# Altium project Cloud_Tub_Controller.PrjPcb
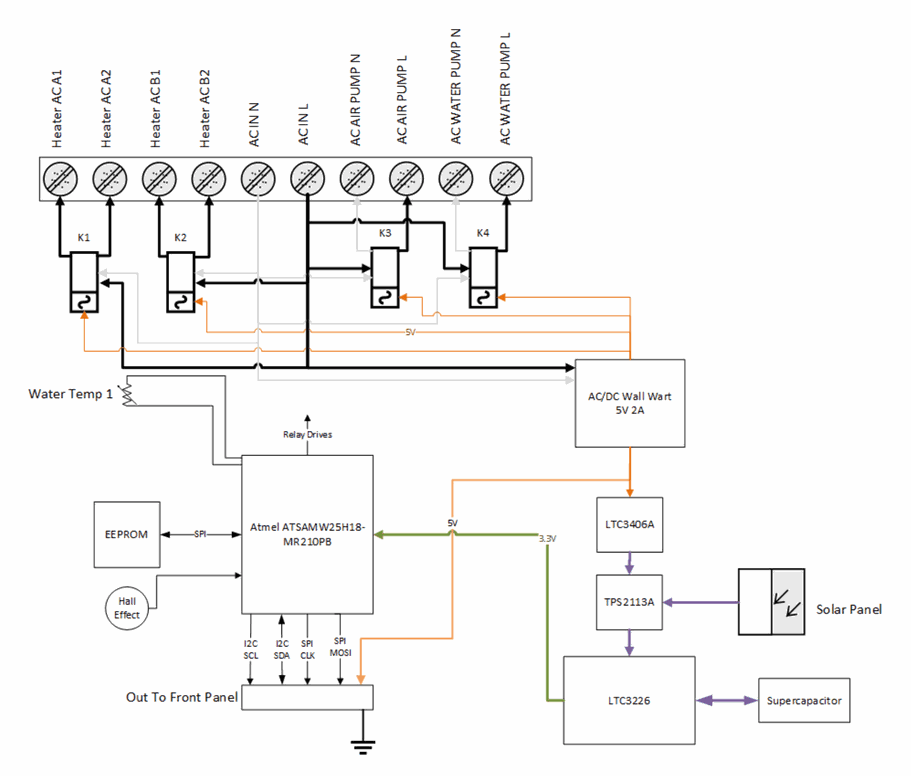
[diagram p0: PAGE1_BLOCK_DIAGRAM.SchDoc]
4 sheets, 98 parts. Net scope: flat (ports and power ports of the same name join across sheets).
Board file: PCB.PcbDoc
Sheets:
  PAGE1_BLOCK_DIAGRAM.SchDoc
  PAGE2_ATMEL.SchDoc
  PAGE3_POWER.SchDoc
  PAGE4_RELAYS.SchDoc

## Sheet PAGE1_BLOCK_DIAGRAM.SchDoc
size A; DrawnBy: Sean Donohue; Revision: A; SheetNumber: 1; SheetTotal: 4; Title2: BLOCK DIAGRAM

### Notes on the sheet
- 1
- 2
- 3
- 4
- A
- B
- C
- D
- Title
- Drawn:
- Number:
- Rev:
- File:
- Date:
- Time:
- Sheet
- of

## Sheet PAGE2_ATMEL.SchDoc
size A; DrawnBy: Sean Donohue; Revision: A; SheetNumber: 2; SheetTotal: 4; Title2: ATMEL
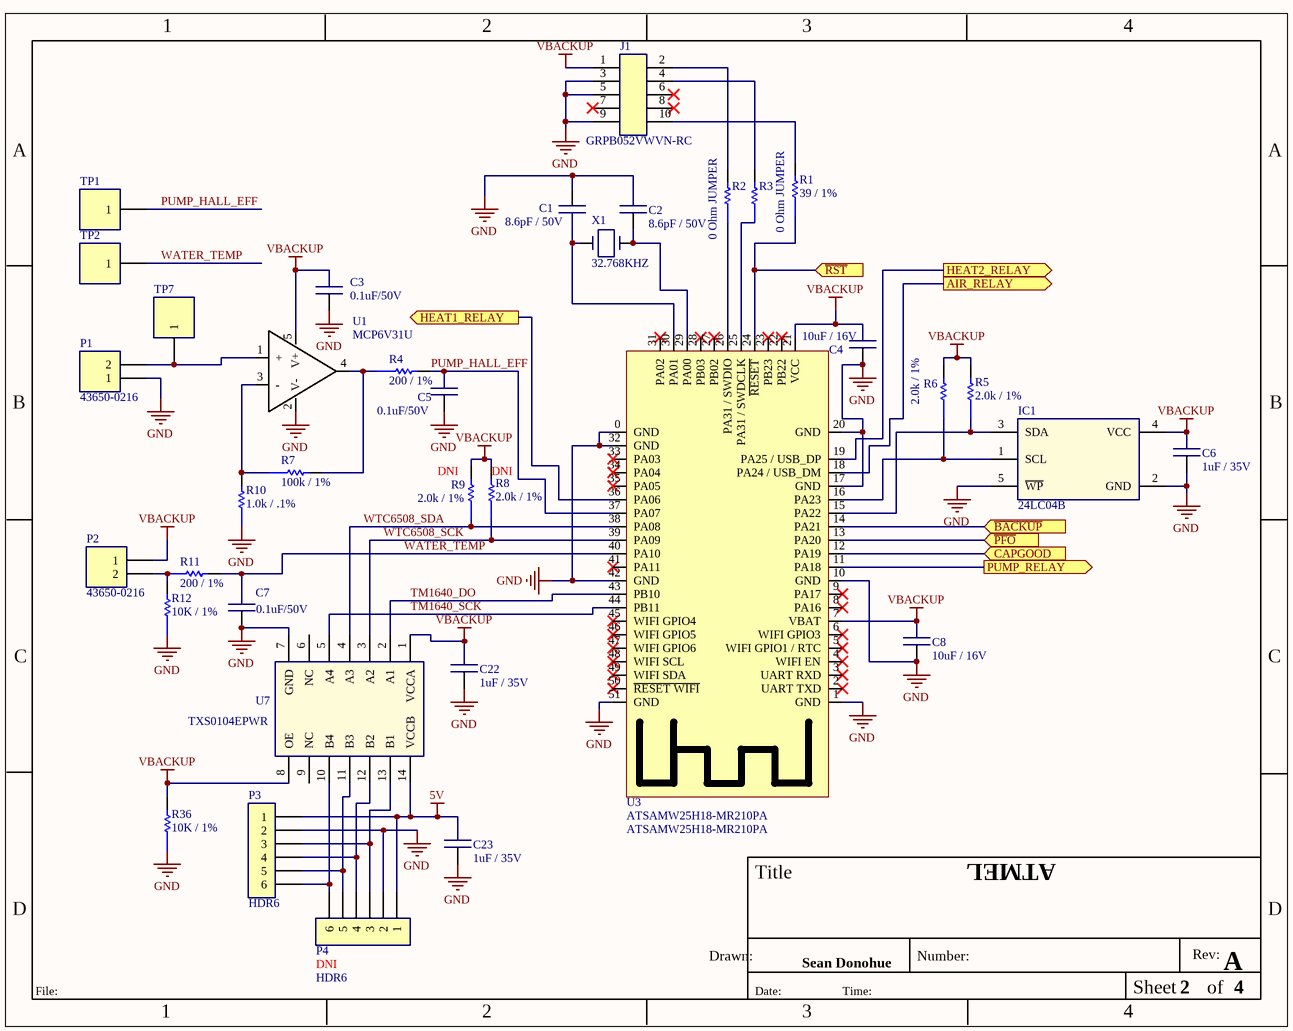
[diagram p1: PAGE2_ATMEL.SchDoc]

### Parts
C1  value 8.6pF / 50V  [0603]  (hidden comment: cap)
C2  value 8.6pF / 50V  [0603]  (hidden comment: cap)
C3  value 0.1uF/50V  [0603]  (hidden comment: cap)
C4  value 10uF / 16V  [0603]  (hidden comment: cap)
C5  value 0.1uF/50V  [0603]  (hidden comment: cap)
C6  value 1uF / 35V  [0603]  (hidden comment: cap)
C7  value 0.1uF/50V  [0603]  (hidden comment: cap)
C8  value 10uF / 16V  [0603]  (hidden comment: cap)
C22  value 1uF / 35V  [0603]  (hidden comment: cap)
C23  value 1uF / 35V  [0603]  (hidden comment: cap)
IC1  24LC04B  [SOT-23-5]
J1  value GRPB052VWVN-RC  [conn_10p_050mil]  (hidden comment: Header 10D)
P1  value 43650-0216  [conn_molex_2p_43650-0215]  (hidden comment: Header 2)
P2  value 43650-0216  [conn_molex_2p_43650-0215]  (hidden comment: Header 2)
P3  value HDR6  [HDR1X6]  (hidden comment: Header 6)
P4  value HDR6  LOAD: DNI  [HDR1X6]  (hidden comment: Header 6)
R1  value 39 / 1%  [0603]  (hidden comment: Res)
R2  value 0 Ohm JUMPER  [0603]  (hidden comment: Res)
R3  value 0 Ohm JUMPER  [0603]  (hidden comment: Res)
R4  value 200 / 1%  [0603]  (hidden comment: Res)
R5  value 2.0k / 1%  [0603]  (hidden comment: Res)
R6  value 2.0k / 1%  [0603]  (hidden comment: Res)
R7  value 100k / 1%  [0603]  (hidden comment: Res)
R8  value 2.0k / 1%  LOAD: DNI  [0603]  (hidden comment: Res)
R9  value 2.0k / 1%  LOAD: DNI  [0603]  (hidden comment: Res)
R10  value 1.0k / .1%  [0603]  (hidden comment: Res)
R11  value 200 / 1%  [0603]  (hidden comment: Res)
R12  value 10K / 1%  [0603]  (hidden comment: Res)
R36  value 10K / 1%  [0603]  (hidden comment: Res)
TP1  Header 1  [HDR1]  (value not drawn)
TP2  Header 1  [HDR1]  (value not drawn)
TP7  Header 1  [HDR1]  (value not drawn)
U1  MCP6V31U  [SOT-23-5]
U3  ATSAMW25H18-MR210PA  [ATSAMW25H18-MR210PA]
U7  TXS0104EPWR  [TSSOP-14]
X1  value 32.768KHZ  [FC-13F]  (hidden comment: crystal)

### Ports
AIR_RELAY (out), CAPGOOD (in), HEAT1_RELAY (out), HEAT2_RELAY (out), PUMP_RELAY (out), ~{BACKUP} (in), ~{PFO} (in), ~{RST} (in)

### Nets
5V: C23.1 P3.1 P4.1 U7.14(VCCB)
GND: C1.2 C2.1 C3.2 C4.2 C5.2 C6.2 C7.2 C8.2 C22.2 C23.2 IC1.2(GND) IC1.5(~{WP}) J1.3 J1.5 J1.9 P1.1 P3.2 P4.2 R10.1 R12.1 R36.1 U1.2(V-) U3.0(GND) U3.1(GND) U3.10(GND) U3.17(GND) U3.20(GND) U3.32(GND) U3.42(GND) U3.51(GND) U7.7(GND)
VBACKUP: C3.1 C4.1 C6.1 C8.1 C22.1 IC1.4(VCC) J1.1 P2.1 R5.2 R6.2 R8.2 R9.2 R36.2 U1.5(V+) U3.7(VBAT) U3.21(VCC) U7.1(VCCA) U7.8(OE)
PUMP_HALL_EFF: C5.1 R4.2 TP1.1 U3.37(PA07)
TM1640_DO: U3.43(PB10) U7.2(A1)
TM1640_SCK: U3.44(PB11) U7.5(A4)
WATER_TEMP: C7.1 R11.2 TP2.1 U3.40(PA10)
WTC6508_SCK: R8.1 U3.39(PA09) U7.3(A2)
WTC6508_SDA: R9.1 U3.38(PA08) U7.4(A3)
NetC1_1: C1.1 U3.30(PA01) X1.1
NetC2_2: C2.2 U3.29(PA00) X1.2
NetIC1_1: IC1.1(SCL) R6.1 U3.16(PA23)
NetIC1_3: IC1.3(SDA) R5.1 U3.15(PA22)
NetJ1_2: J1.2 R2.2
NetJ1_4: J1.4 R3.2
NetJ1_10: J1.10 R1.2
NetP1_2: P1.2 TP7.1 U1.1(+)
NetP2_2: P2.2 R11.1 R12.2
NetP3_3: P3.3 P4.3 U7.13(B1)
NetP3_4: P3.4 P4.4 U7.12(B2)
NetP3_5: P3.5 P4.5 U7.11(B3)
NetP3_6: P3.6 P4.6 U7.10(B4)
NetR1_1: R1.1 U3.24(~{RESET}) ; port ~{RST}
NetR2_1: R2.1 U3.26(PA31_/_SWDIO)
NetR3_1: R3.1 U3.25(PA31_/_SWDCLK)
NetR4_1: R4.1 R7.2 U1.4(OUTA)
NetR7_1: R7.1 R10.2 U1.3(-)
NetR17_1: U3.14(PA21) ; port ~{BACKUP}
NetR25_1: U3.12(PA19) ; port CAPGOOD
NetR26_1: U3.13(PA20) ; port ~{PFO}
NetR28_1: U3.19(PA25_/_USB_DP) ; port HEAT2_RELAY
NetR29_1: U3.11(PA18) ; port PUMP_RELAY
NetR30_1: U3.18(PA24_/_USB_DM) ; port AIR_RELAY
NetR34_1: U3.36(PA06) ; port HEAT1_RELAY

Not connected (* = marked no-connect by the designer): J1 6* 7* 8*; U3 2(UART_TXD)* 3(UART_RXD)* 4(WIFI_EN)* 5(WIFI_GPIO1_/_RTC)* 6(WIFI_GPIO3)* 8(PA16)* 9(PA17)* 22(PB22)* 23(PB23)* 27(PB02)* 28(PB03)* 31(PA02)* 33(PA03)* 34(PA04)* 35(PA05)* 41(PA11)* 45(WIFI_GPIO4)* 46(WIFI_GPIO5)* 47(WIFI_GPIO6)* 48(WIFI_SCL)* 49(WIFI_SDA)* 50(~{RESET_WIFI})*; U7 6(NC) 9(NC)

### Notes on the sheet
- 1
- 2
- 3
- 4
- A
- B
- C
- D
- Title
- Drawn:
- Number:
- Rev:
- File:
- Date:
- Time:
- Sheet
- of

### Library data of the parts
C1 C2 = EXC143: CAP CER 8.2PF 50V NP0 0603; EetrexPN: EXC143; Mfg: KEMET; MfgPN: C0603C829J5GACTU; Vendor: Digikey; VendorPN: 399-7965-1-ND; Unit Cost: 0.25; Temp: -55°C ~ 125°C
C3 C5 C7 = ECM1045XQ: CAP CER 0.1UF 50V 10% X7R 0603; Mfg: Murata; MfgPN: GRM188R71H104KA93D; Vendor: Digikey; VendorPN: 490-1519-1-ND; Alt Mfg: TDK; Alt PN: C1608X7R1H104K; Unit Cost: 0.1; Temp: -55°C ~ 125°C; COST/10: 0.041; COST/50: 0.0222; COST/100: 0.0187; COST/500: 0.0131; EetrexPN: ECM1045XQ
C4 C8 = EXC142: CAP CER 10UF 16V X5R 0603; EetrexPN: EXC142; Mfg: Taiyo Uden; MfgPN: EMK107BBJ106MA-T; Vendor: Digkey; VendorPN: 587-3238-1-ND; Unit Cost: 0.63; Temp: -55°C ~ 85°C
C6 C22 C23 = EXC144: CAP CER 1UF 35V X7R 0603; EetrexPN: EXC144; Mfg: Murata; MfgPN: GRM188R7YA105KA12D; Vendor: Digikey; VendorPN: 490-10487-1-ND; Unit Cost: 0.27; Temp: -55°C ~ 125°C
IC1 = EXM2404ST: IC SERIAL EEPROM 4K 2.5V SOT23-5; Mfg: Microchip; MfgPN: 24LC04BT-I/OT; Vendor: Digikey; VendorPN: 24LC04BT-I/OTCT-ND; Unit Cost: 0.22; Value: 24LC04B; EetrexPN: EXM2404ST
J1 = EKP115: CONN HEADER 10POS 1.27MM GOLD T/H; EetrexPN: EKP115; Mfg: Sullins; Vendor: Digikey; VendorPN: S9015E-05-ND; Unit Cost: 0.90; MfgPN: GRPB052VWVN-RC
P1 P2 = EKP96: CONN HEADER 2POS 3MM VERT GOLD; EetrexPN: EKP96; Mfg: Molex; Vendor: Digikey; VendorPN: WM1922-ND; Alt PN: 43650-0417; Unit Cost: 0.86; Temp: -40°C ~ 105°C; UL: YES; MATE PN: 43645-0200; COST/10: 0.757; COST/50: 0.6826; COST/100: 0.653; COST/500: 0.53424; MfgPN: 43650-0216; Alt Mfg: Molex; CSA: YES
P3 P4 = ekp19: CONN HEADER 6POS .330 tall, TIN; EetrexPN: ekp19; Mfg: Samtec; MfgPN: TSW-106-07-T-S; Vendor: Digikey; VendorPN: SAM1035-06-ND; Unit Cost: 0.50
R1 = ER273: RES 39 OHM 1% 1/10W 0603 SMD; Mfg: Panasonic; MfgPN: ERJ-3EKF39R0V; Vendor: Digikey; VendorPN: P39.0HDKR-ND; EetrexPN: ER273; Unit Cost: 0.1; Temp: -55°C ~ 155°C
R2 R3 = ERE0000JP: RES 0.0 OHM 1/10W 0603 SMD; Mfg: Stackpole; MfgPN: RMCF0603ZT0R00; Vendor: Digikey; VendorPN: RMCF0603ZT0R00CT-ND; Alt Mfg: Panasonic; Alt PN: ERJ-3GEY0R00V; Unit Cost: 0.02; Temp: -55°C ~ 155°C; COST/10: 0.017; COST/50: 0.0092; COST/100: 0.007; COST/500: 0.00384; EetrexPN: ERE0000JP
R4 R11 = ER264: RES 200 OHM 1% 1/10W 0603 SMD; Mfg: Panasonic; MfgPN: ERJ-3EKF2000V; Vendor: Digikey; VendorPN: P200HCT-ND; EetrexPN: ER264; Unit Cost: 0.1; Temp: -55°C ~ 155°C
R5 R6 R8 R9 = ERE2001FP: RES 2.00K OHM 1/10W 1% 0603 SMD; Mfg: Vishay; MfgPN: CRCW06032K00FKEA; Vendor: Digikey; VendorPN: 541-2.00KHCT-ND; Alt Mfg: Panasonic; Alt PN: ERJ-3EKF2001V; Unit Cost: 0.081; Temp: -55°C ~ 155°C; COST/50: 0.0436; COST/500: 0.0251; EetrexPN: ERE2001FP; COST/10: 0.081; COST/100: 0.0436
R7 = ERE1003FP: RES 100K OHM 1/10W 1% 0603 SMD; Mfg: Panasonic; MfgPN: ERJ-3EKF1003V; Vendor: Digikey; VendorPN: P100KHCT-ND; Alt Mfg: Yageo; Alt PN: RC0603FR-07100KL; Unit Cost: 0.1; Temp: '-55°C ~ 125°C; COST/50: 0.015; COST/100: 0.0114; COST/500: 0.00624; EetrexPN: ERE1003FP; COST/10: 0.1
R10 = ERE1001BP: RES 1.0K OHM 1/10W .1% 0603 SMD; Mfg: Panasonic; MfgPN: ERA-3AEB102V; Vendor: Digikey; VendorPN: P1.0KDBCT-ND; Alt Mfg: Susumu; Alt PN: RG1608P-102-B-T5; Unit Cost: 0.124; Ref: ER150; EetrexPN: ERE1001BP
R12 R36 = ER275: RES 10K OHM 1% 1/8W 0603 SMD; Mfg: Vishay; MfgPN: MCT06030C1002FP500; Vendor: Digikey; VendorPN: MCT0603-10.0K-CFCT-ND; EetrexPN: ER275; Unit Cost: 0.17; Temp: -55°C ~ 155°C
TP1 TP2 TP7 = ekp17: CONN HEADER 1POS .330 tall, TIN; Value: HDR1; EetrexPN: ekp17; Mfg: Samtec; MfgPN: TSW-101-07-T-S; Vendor: Digikey; VendorPN: SAM1035-01-ND; Unit Cost: 0.36
U1 = E326: IC OPAMP ZRO-DRFT 300KHZ SC70-5; EetrexPN: E326; Mfg: MicroChip; MfgPN: MCP6V31UT-E/LT; Vendor: Digikey; VendorPN: MCP6V31UT-E/LTCT-ND; Unit Cost: 1.08; Temp: -40°C ~ 125°C; COST/100: 0.82; Value: MCP6V31U
U3 = E329: RF TXRX MODULE WIFI TRACE ANT; EetrexPN: E329; Mfg: Atmel; Vendor: Digikey; VendorPN: ATSAMW25H18-MR210PA-ND; Unit Cost: 26.25; Temp: -40°C ~ 85°C; COST/10: 24.235; COST/100: 20.5326; COST/500: 18.7; Value: ATSAMW25H18-MR210PA; MfgPN: ATSAMW25H18-MR210PA
U7 = E334: IC 4BIT NON-INV TRANSLTR 14TSSOP; EetrexPN: E334; Mfg: Texas Instruments; Vendor: Digikey; VendorPN: 296-20697-1-ND; Unit Cost: 1.44; Temp: -40°C ~ 85°C; Value: TXS0104EPWR; MfgPN: TXS0104EPWR
X1 = EQX7: CRYSTAL 32.768KHZ 7PF SMD; EetrexPN: EQX7; Mfg: AVX; MfgPN: ST3215SB32768C0HPWBB; Vendor: Digikey; VendorPN: 1253-1113-1-ND; Unit Cost: 0.87; TEMP: -40°C ~ 85°C; COST/10: 0.774; COST/50: 0.7232; COST/100: 0.64; COST/500: 0.6048

## Sheet PAGE3_POWER.SchDoc
size A; DrawnBy: Sean Donohue; Revision: A; SheetNumber: 3; SheetTotal: 4; Title2: POWER
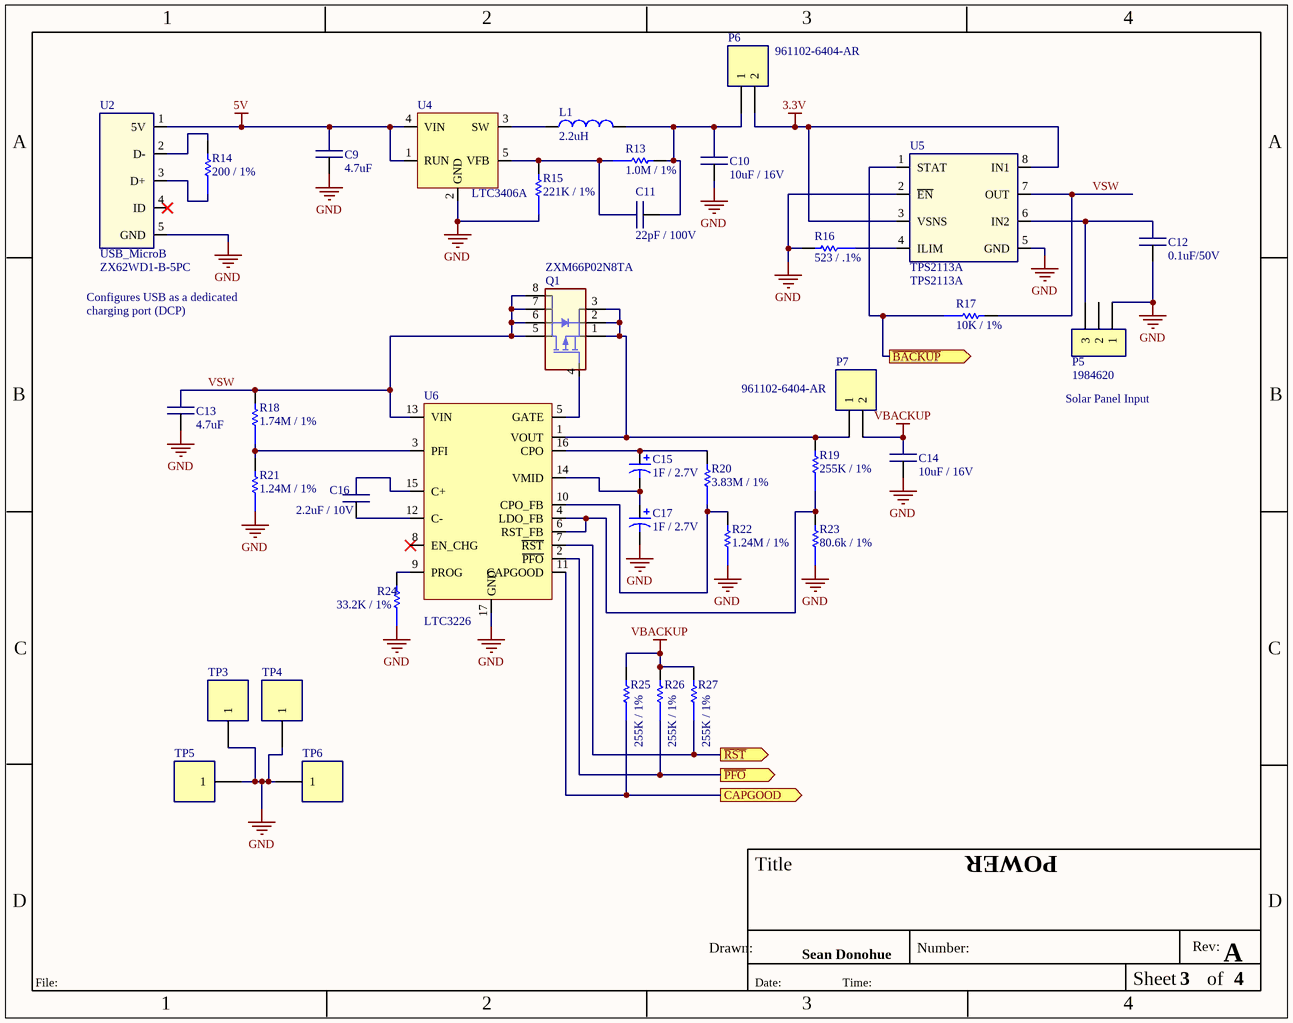
[diagram p2: PAGE3_POWER.SchDoc]

### Parts
C9  value 4.7uF  [0805]  (hidden comment: cap)
C10  value 10uF / 16V  [0603]  (hidden comment: cap)
C11  value 22pF / 100V  [0603]  (hidden comment: cap)
C12  value 0.1uF/50V  [0603]  (hidden comment: cap)
C13  value 4.7uF  [0805]  (hidden comment: cap)
C14  value 10uF / 16V  [0603]  (hidden comment: cap)
C15  value 1F / 2.7V  [Cap8x11_5]  (hidden comment: Cap Pol)
C16  value 2.2uF / 10V  [0603]  (hidden comment: cap)
C17  value 1F / 2.7V  [Cap8x11_5]  (hidden comment: Cap Pol)
L1  value 2.2uH  [LQH32C]  (hidden comment: Inductor)
P5  value 1984620  [CONN_PHOENIX_3P_1984620]  (hidden comment: Header 3)
P6  value 961102-6404-AR  [HDR1X2]  (hidden comment: Header 2)
P7  value 961102-6404-AR  [HDR1X2]  (hidden comment: Header 2)
Q1  value ZXM66P02N8TA  [SO-8]  (hidden comment: PMOS_POWER-8)
R13  value 1.0M / 1%  [0603]  (hidden comment: Res)
R14  value 200 / 1%  [0603]  (hidden comment: Res)
R15  value 221K / 1%  [0603]  (hidden comment: Res)
R16  value 523 / .1%  [0603]  (hidden comment: Res)
R17  value 10K / 1%  [0603]  (hidden comment: Res)
R18  value 1.74M / 1%  [0603]  (hidden comment: Res)
R19  value 255K / 1%  [0603]  (hidden comment: Res)
R20  value 3.83M / 1%  [0603]  (hidden comment: Res)
R21  value 1.24M / 1%  [0603]  (hidden comment: Res)
R22  value 1.24M / 1%  [0603]  (hidden comment: Res)
R23  value 80.6k / 1%  [0603]  (hidden comment: Res)
R24  value 33.2K / 1%  [0603]  (hidden comment: Res)
R25  value 255K / 1%  [0603]  (hidden comment: Res)
R26  value 255K / 1%  [0603]  (hidden comment: Res)
R27  value 255K / 1%  [0603]  (hidden comment: Res)
TP3  Header 1  [HDR1]  (value not drawn)
TP4  Header 1  [HDR1]  (value not drawn)
TP5  Header 1  [HDR1]  (value not drawn)
TP6  Header 1  [HDR1]  (value not drawn)
U2  USB_MicroB  value ZX62WD1-B-5PC  [ZX62WD1-B-5PC]
U4  LTC3406A  [TSOT-23-5]
U5  TPS2113A  [TSSOP-8]
U6  LTC3226  [WFQFN-16]

### Ports
CAPGOOD (out), ~{BACKUP} (out), ~{PFO} (out), ~{RST} (out)

### Nets
3.3V: P6.2 U5.3(VSNS) U5.8(IN1)
5V: C9.1 U2.1(5V) U4.1(RUN) U4.4(VIN)
GND: C9.2 C10.2 C12.2 C13.2 C14.2 C17.2 P5.1 R15.1 R16.2 R21.1 R22.1 R23.1 R24.1 TP3.1 TP4.1 TP5.1 TP6.1 U2.5(GND) U4.2(GND) U5.2(~{EN}) U5.5(GND) U6.17(GND)
VBACKUP: C14.1 P7.2 R25.2 R26.2 R27.2
VSW: C13.1 Q1.5(D) Q1.6(D) Q1.7(D) Q1.8(D) R17.2 R18.2 U5.7(OUT) U6.13(VIN)
NetC10_1: C10.1 C11.2 L1.2 P6.1 R13.2
NetC11_1: C11.1 R13.1 R15.2 U4.5(VFB)
NetC12_1: C12.1 P5.3 U5.6(IN2)
NetC15_1: C15.1 R20.2 U6.16(CPO)
NetC15_2: C15.2 C17.1 U6.14(VMID)
NetC16_1: C16.1 U6.15(C+)
NetC16_2: C16.2 U6.12(C-)
NetL1_1: L1.1 U4.3(SW)
NetP7_1: P7.1 Q1.1(S) Q1.2(S) Q1.3(S) R19.2 U6.1(VOUT)
NetQ1_4: Q1.4(G) U6.5(GATE)
NetR1_1: R27.1 U6.7(~{RST}) ; port ~{RST}
NetR14_1: R14.1 U2.3(D+)
NetR14_2: R14.2 U2.2(D-)
NetR16_1: R16.1 U5.4(ILIM)
NetR17_1: R17.1 U5.1(STAT) ; port ~{BACKUP}
NetR18_1: R18.1 R21.2 U6.3(PFI)
NetR19_1: R19.1 R23.2 U6.4(LDO_FB) U6.6(RST_FB)
NetR20_1: R20.1 R22.2 U6.10(CPO_FB)
NetR24_2: R24.2 U6.9(PROG)
NetR25_1: R25.1 U6.11(CAPGOOD) ; port CAPGOOD
NetR26_1: R26.1 U6.2(~{PFO}) ; port ~{PFO}

Not connected (* = marked no-connect by the designer): P5 2; U2 4(ID)*; U6 8(EN_CHG)*

### Notes on the sheet
- Configures USB as a dedicated charging port (DCP)
- Solar Panel Input
- 1
- 2
- 3
- 4
- A
- B
- C
- D
- Title
- Drawn:
- Number:
- Rev:
- File:
- Date:
- Time:
- Sheet
- of

### Library data of the parts
C9 C13 = ECC4702XR: CAP 4.7uF 16V X7R 0805; Mfg: Murata; MfgPN: GRM21BR71C475KA73L; Vendor: Digikey; VendorPN: 490-4522-1; Unit Cost: 0.88; Temp: '-55°C ~ 125°C; EetrexPN: ECC4702XR
C10 C14 = EXC142: as C4 on sheet PAGE2_ATMEL
C11 = EXC140: CAP CER 22PF 100V NP0 0603; EetrexPN: EXC140; Mfg: KEMET; MfgPN: C0603C220J1GACTU; Vendor: Digikey; VendorPN: 399-7874-1-ND; Unit Cost: 0.1; Temp: -55°C ~ 125°C
C12 = ECM1045XQ: as C3 on sheet PAGE2_ATMEL; EetrexPN: ECM1045XQ
C15 C17 = EXC139: CAP 1F 2.7V THROUGH HOLE; EetrexPN: EXC139; Mfg: Maxwell; MfgPN: BCAP0001 P270 T01; Vendor: Digikey; VendorPN: 1182-1006-ND; Unit Cost: 2.3; Temp: -40°C ~ 85°C
C16 = EXC141: CAP CER 2.2UF 10V X7R 0603; EetrexPN: EXC141; Mfg: Samsung; MfgPN: CL10B225KP8NFNC; Vendor: Digikey; VendorPN: 1276-2016-1-ND; Unit Cost: 0.15; Temp: -55°C ~ 125°C
L1 = EL48: FIXED IND 2.2UH 790MA 97 MOHM; EetrexPN: EL48; Mfg: Murata; MfgPN: LQH32CN2R2M53L; Vendor: Digikey; VendorPN: 490-4056-1-ND; Unit Cost: 0.35; Temp: -40°C ~ 85°C
P5 = EKP73: CONN TERM BLOCK T/H 3POS 3.5MM; EetrexPN: EKP73; Mfg: Phoenix Contact; Vendor: Digikey; VendorPN: 277-1722-ND; Unit Cost: 0.55; UL: YES; MfgPN: 1984620; CSA: YES
P6 P7 = EKP117: CONN HEADER VERT SGL 2POS GOLD; EetrexPN: EKP117; Mfg: 3M; Vendor: Digikey; VendorPN: 3M9447-ND; Unit Cost: 0.16; MfgPN: 961102-6404-AR
Q1 = E333: MOSFET P-CH 20V 8A 8-SOIC; EetrexPN: E333; Mfg: Diodes inc; Vendor: Digikey; VendorPN: ZXM66P02N8CT-ND; Unit Cost: 2.61; Temp: -55°C ~ 150°C; MfgPN: ZXM66P02N8TA
R13 = ER265: RES 1M OHM 1% 1/10W 0603 SMD; Mfg: Panasonic; MfgPN: ERJ-3EKF1004V; Vendor: Digikey; VendorPN: P1.00MHCT-ND; EetrexPN: ER265; Unit Cost: 0.1; Temp: -55°C ~ 155°C
R14 = ER264: as R4 on sheet PAGE2_ATMEL
R15 = ER266: RES 221K OHM 1% 1/10W 0603 SMD; Mfg: Panasonic; MfgPN: ERJ-3EKF2213V; Vendor: Digikey; VendorPN: P221KHCT-ND; EetrexPN: ER266; Unit Cost: 0.1; Temp: -55°C ~ 155°C
R16 = ERE5230BP: RES 523 OHM 1/10W .1% 0603 SMD; Mfg: Susumu; MfgPN: RG1608P-5230-B-T5; Vendor: Digikey; VendorPN: RG16P523BCT-ND; Alt Mfg: Panasonic; Alt PN: ERA-3AEB5230V; Unit Cost: 0.204; Ref: ER149; EetrexPN: ERE5230BP
R17 = ER275: as R12 on sheet PAGE2_ATMEL
R18 = ER268: RES 1.74M OHM 1% 1/10W 0603 SMD; Mfg: Vishay; MfgPN: CRCW06031M74FKEA; Vendor: Digikey; VendorPN: 541-1.74MHCT-ND; EetrexPN: ER268; Unit Cost: 0.1; Temp: -55°C ~ 155°C
R19 R25-R27 = ER270: RES 255K OHM 1% 1/10W 0603 SMD; Mfg: Panasonic; MfgPN: ERJ-3EKF2553V; Vendor: Digikey; VendorPN: P255KHCT-ND; EetrexPN: ER270; Unit Cost: 0.1; Temp: -55°C ~ 155°C
R20 = ER272: RES 3.83M OHM 1% 1/10W 0603 SMD; Mfg: Vishay; MfgPN: CRCW06033M83FKEA; Vendor: Digikey; VendorPN: 541-3.83MHCT-ND; EetrexPN: ER272; Unit Cost: 0.1; Temp: -55°C ~ 155°C
R21 R22 = ER269: RES 1.24M OHM 1% 1/10W 0603 SMD; Mfg: Vishay; MfgPN: CRCW06031M24FKEA; Vendor: Digikey; VendorPN: 541-1.24MHCT-ND; EetrexPN: ER269; Unit Cost: 0.1; Temp: -55°C ~ 155°C
R23 = ER271: RES 80.6K OHM 1% 1/10W 0603 SMD; Mfg: Panasonic; MfgPN: ERJ-3EKF8062V; Vendor: Digikey; VendorPN: P80.6KHCT-ND; EetrexPN: ER271; Unit Cost: 0.1; Temp: -55°C ~ 155°C
R24 = ER267: RES 33.2K OHM 1% 1/10W 0603 SMD; Mfg: Panasonic; MfgPN: ERJ-3EKF3322V; Vendor: Digikey; VendorPN: P33.2KHCT-ND; EetrexPN: ER267; Unit Cost: 0.1; Temp: -55°C ~ 155°C
TP3-TP6 = ekp17: as TP1 on sheet PAGE2_ATMEL
U2 = EKP114: CONN RCPT MICRO USB B SPLASH PRF; EetrexPN: EKP114; Mfg: Hirose; Vendor: Digikey; VendorPN: H12193CT-ND; Unit Cost: 2.00; Temp: -40°C ~ 85°C; MfgPN: ZX62WD1-B-5PC
U4 = E332: IC REG BUCK ADJ 0.6A SYNC TSOT23; EetrexPN: E332; Mfg: Linear Tech; MfgPN: LTC3406ABES5#TRMPBF; Vendor: Digikey; VendorPN: LTC3406ABES5#TRMPBFCT-ND; Unit Cost: 4.22; Temp: -40°C ~ 85°C; Value: LTC3406A
U5 = E331: IC OR CTRLR SRC SELECT 8TSSOP; EetrexPN: E331; Mfg: Texas Instruments; MfgPN: TPS2113APWR; Vendor: Digikey; VendorPN: 296-16938-1-ND; Unit Cost: 2.05; Temp: -40°C ~ 85°C; Value: TPS2113A
U6 = E330: IC 2CELL SUPERCAP CHARGE 16QFN; EetrexPN: E330; Mfg: Linear Tech; MfgPN: LTC3226EUD#PBF; Vendor: Digikey; VendorPN: LTC3226EUD#PBF-ND; Unit Cost: 5.7; Temp: -40°C ~ 125°C; Value: LTC3226

## Sheet PAGE4_RELAYS.SchDoc
size A; DrawnBy: Sean Donohue; Revision: A; SheetNumber: 4; SheetTotal: 4; Title2: RELAYS
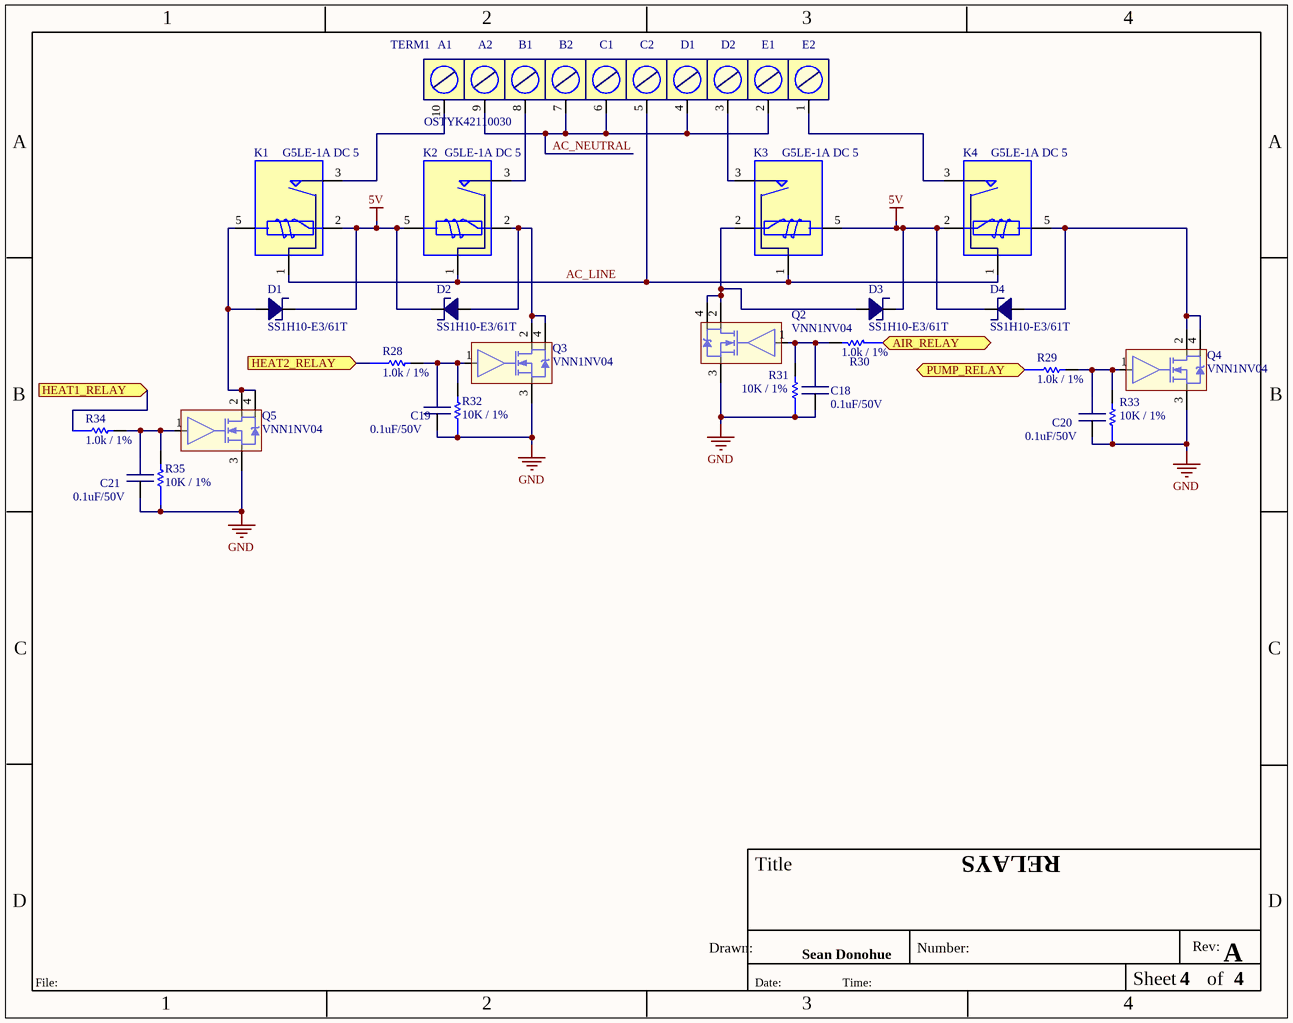
[diagram p3: PAGE4_RELAYS.SchDoc]

### Parts
C18  value 0.1uF/50V  [0603]  (hidden comment: cap)
C19  value 0.1uF/50V  [0603]  (hidden comment: cap)
C20  value 0.1uF/50V  [0603]  (hidden comment: cap)
C21  value 0.1uF/50V  [0603]  (hidden comment: cap)
D1  value SS1H10-E3/61T  [SMAZ]  (hidden comment: ds)
D2  value SS1H10-E3/61T  [SMAZ]  (hidden comment: ds)
D3  value SS1H10-E3/61T  [SMAZ]  (hidden comment: ds)
D4  value SS1H10-E3/61T  [SMAZ]  (hidden comment: ds)
K1  value G5LE-1A DC 5  [G5LE-SPST]  (hidden comment: G5LE-SPST)
K2  value G5LE-1A DC 5  [G5LE-SPST]  (hidden comment: G5LE-SPST)
K3  value G5LE-1A DC 5  [G5LE-SPST]  (hidden comment: G5LE-SPST)
K4  value G5LE-1A DC 5  [G5LE-SPST]  (hidden comment: G5LE-SPST)
Q2  value VNN1NV04  [SOT-223-4]  (hidden comment: NMOS-SOT-223-4)
Q3  value VNN1NV04  [SOT-223-4]  (hidden comment: NMOS-SOT-223-4)
Q4  value VNN1NV04  [SOT-223-4]  (hidden comment: NMOS-SOT-223-4)
Q5  value VNN1NV04  [SOT-223-4]  (hidden comment: NMOS-SOT-223-4)
R28  value 1.0k / 1%  [0603]  (hidden comment: Res)
R29  value 1.0k / 1%  [0603]  (hidden comment: Res)
R30  value 1.0k / 1%  [0603]  (hidden comment: Res)
R31  value 10K / 1%  [0603]  (hidden comment: Res)
R32  value 10K / 1%  [0603]  (hidden comment: Res)
R33  value 10K / 1%  [0603]  (hidden comment: Res)
R34  value 1.0k / 1%  [0603]  (hidden comment: Res)
R35  value 10K / 1%  [0603]  (hidden comment: Res)
TERM1  value OSTYK42110030  [BARRIER-STRP-10]  (hidden comment: BARR-STRP-10)

### Ports
AIR_RELAY (in), HEAT1_RELAY (in), HEAT2_RELAY (in), PUMP_RELAY (in)

### Nets
5V: D1.1(C) D2.1(C) D3.1(C) D4.1(C) K1.2 K2.5 K3.5 K4.2
GND: C18.2 C19.2 C20.2 C21.2 Q2.3(S) Q3.3(S) Q4.3(S) Q5.3(S) R31.1 R32.1 R33.1 R35.1
AC_LINE: K1.1 K2.1 K3.1 K4.1 TERM1.5
AC_NEUTRAL: TERM1.2 TERM1.4 TERM1.6 TERM1.7 TERM1.9
NetC18_1: C18.1 Q2.1(G) R30.2 R31.2
NetC19_1: C19.1 Q3.1(G) R28.2 R32.2
NetC20_1: C20.1 Q4.1(G) R29.2 R33.2
NetC21_1: C21.1 Q5.1(G) R34.2 R35.2
NetD1_2: D1.2(A) K1.5 Q5.2(D) Q5.4(D)
NetD2_2: D2.2(A) K2.2 Q3.2(D) Q3.4(D)
NetD3_2: D3.2(A) K3.2 Q2.2(D) Q2.4(D)
NetD4_2: D4.2(A) K4.5 Q4.2(D) Q4.4(D)
NetK1_3: K1.3 TERM1.10
NetK2_3: K2.3 TERM1.8
NetK3_3: K3.3 TERM1.3
NetK4_3: K4.3 TERM1.1
NetR28_1: R28.1 ; port HEAT2_RELAY
NetR29_1: R29.1 ; port PUMP_RELAY
NetR30_1: R30.1 ; port AIR_RELAY
NetR34_1: R34.1 ; port HEAT1_RELAY

### Notes on the sheet
- (near TERM1) A1
- (near TERM1) A2
- (near TERM1) B1
- (near TERM1) B2
- (near TERM1) C1
- (near TERM1) C2
- (near TERM1) D1
- (near TERM1) D2
- (near TERM1) E1
- (near TERM1) E2
- 1
- 2
- 3
- 4
- A
- B
- C
- D
- Title
- Drawn:
- Number:
- Rev:
- File:
- Date:
- Time:
- Sheet
- of

### Library data of the parts
C18-C21 = ECM1045XQ: as C3 on sheet PAGE2_ATMEL; EetrexPN: ECM1045XQ
D1-D4 = ED93: DIODE SCHOTTKY 100V 1A DO214AC; EetrexPN: ED93; Mfg: Vishay; Vendor: Digikey; VendorPN: SS1H10-E3/61TGICT-ND; Unit Cost: 0.371; TEMP: 175°C; MfgPN: SS1H10-E3/61T
K1-K4 = ELME53: RELAY GEN PURPOSE SPST 16A 5V; EetrexPN: ELME53; Mfg: Omron; MfgPN: G5LE-1A-E DC5; Vendor: Digikey; VendorPN: Z2619-ND; Unit Cost: 2.3; TEMP: -40°C ~ 85°C
Q2-Q5 = EXS0413NT: MOSFET N-CH 40V 1.7A SOT223; Mfg: ST Micro; MfgPN: VNN1NV0413TR; Vendor: Digikey; VendorPN: 497-11713-1-ND; Unit Cost: 1.19; Ref: E133; Temp: '-40°C ~ 150°C; COST/10: 1.05; COST/50: 0.9476; COST/100: 0.8291; COST/500: 0.64484; EetrexPN: EXS0413NT
R28-R30 R34 = ERE1001FP: RES 1.00K OHM 1/10W 1% 0603 SMD; Mfg: Vishay; MfgPN: CRCW06031K00FKEA; Vendor: Digikey; VendorPN: 541-1.00KHCT-ND; Unit Cost: 0.081; Temp: -55°C ~ 155°C; COST/50: 0.0436; EetrexPN: ERE1001FP; COST/10: 0.081; COST/100: 0.0436; COST/500: 0.0436
R31-R33 R35 = ER275: as R12 on sheet PAGE2_ATMEL
TERM1 = EKP113: CONN BARRIER STRP 10CIRC 0.325"; EetrexPN: EKP113; Mfg: On Shore Technology, Inc.; Vendor: Digikey; VendorPN: ED2952-ND; Unit Cost: 2.25; MfgPN: OSTYK42110030

## Nets that join several sheets
5V: PAGE2_ATMEL (C23.1 P3.1 P4.1 U7.14), PAGE3_POWER (C9.1 U2.1 U4.1 U4.4), PAGE4_RELAYS (8 pins)
GND: PAGE2_ATMEL (31 pins), PAGE3_POWER (22 pins), PAGE4_RELAYS (12 pins)
VBACKUP: PAGE2_ATMEL (18 pins), PAGE3_POWER (5 pins)
NetR1_1: PAGE2_ATMEL (R1.1 U3.24), PAGE3_POWER (R27.1 U6.7)
NetR17_1: PAGE2_ATMEL (U3.14), PAGE3_POWER (R17.1 U5.1)
NetR25_1: PAGE2_ATMEL (U3.12), PAGE3_POWER (R25.1 U6.11)
NetR26_1: PAGE2_ATMEL (U3.13), PAGE3_POWER (R26.1 U6.2)
NetR28_1: PAGE2_ATMEL (U3.19), PAGE4_RELAYS (R28.1)
NetR29_1: PAGE2_ATMEL (U3.11), PAGE4_RELAYS (R29.1)
NetR30_1: PAGE2_ATMEL (U3.18), PAGE4_RELAYS (R30.1)
NetR34_1: PAGE2_ATMEL (U3.36), PAGE4_RELAYS (R34.1)